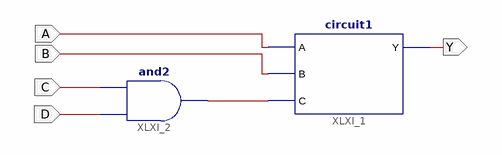
[diagram p0: schematic sheet 1]
// Xilinx ISE schematic circuit2.sch (artix7) as structural Verilog: 2 symbols, 5 ports
module circuit2 (
  input  A,
  input  B,
  input  C,
  input  D,
  output Y
);

  wire XLXN_1;

  circuit1 XLXI_1 (.A(A), .B(B), .C(XLXN_1), .Y(Y));
  and XLXI_2 (XLXN_1, D, C);
endmodule
